# Altium schematic sheet FIT_CONN.SchDoc
size A4; SheetNumber: 24; SheetTotal: 29
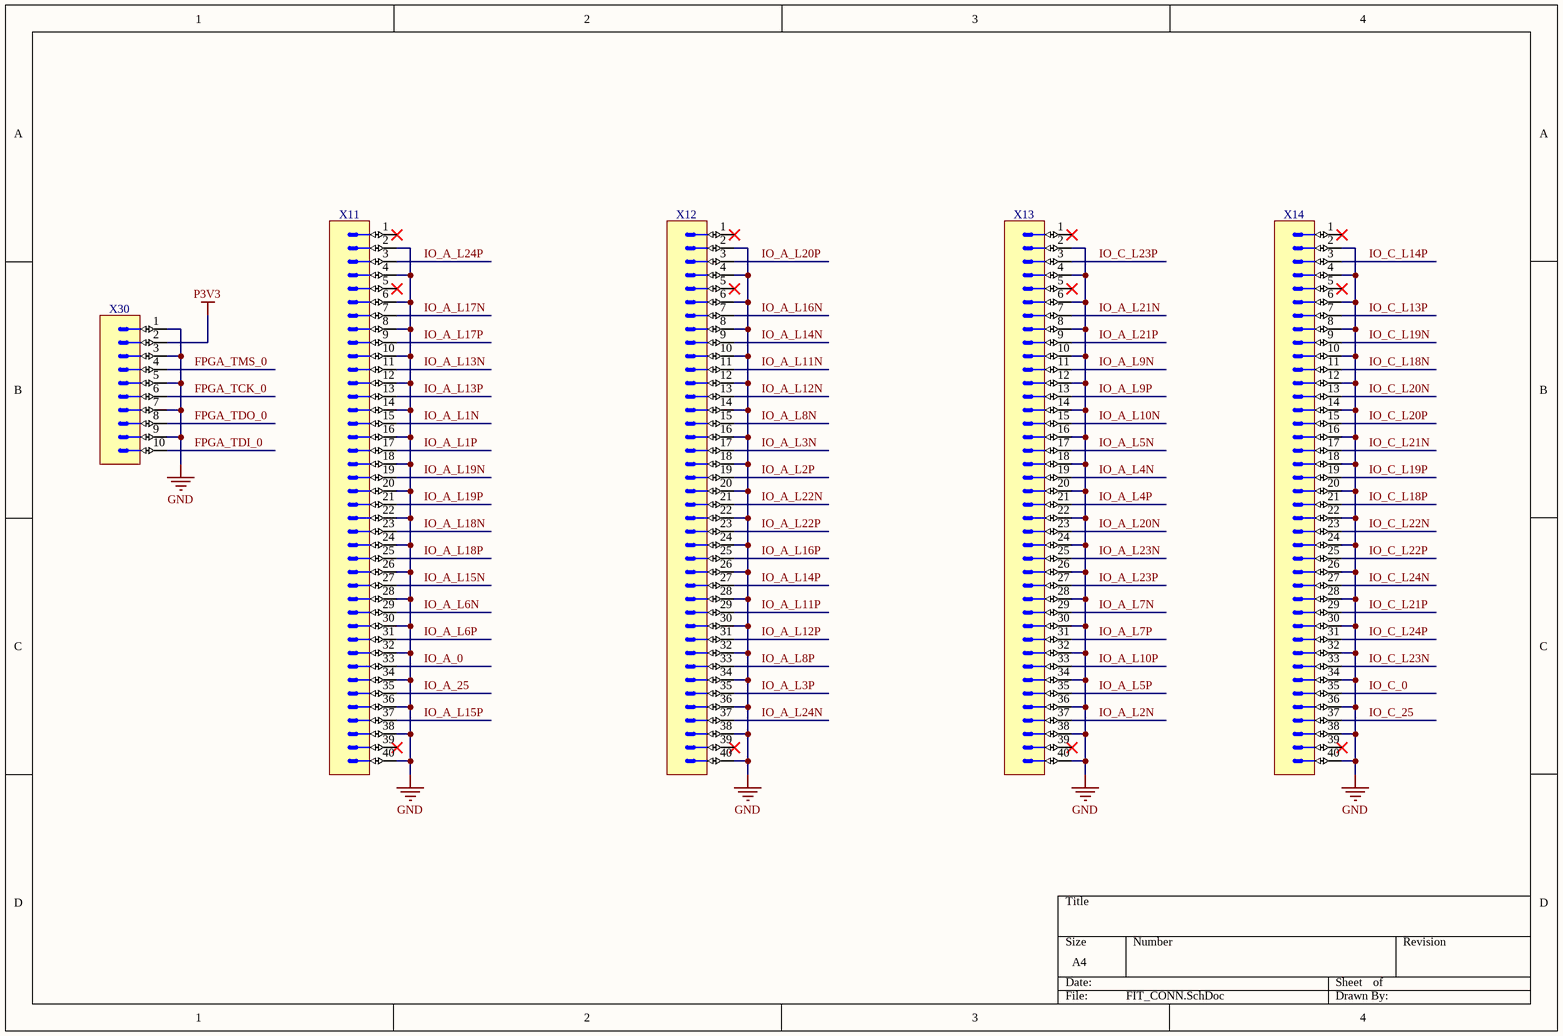
[diagram p0: FIT_CONN.SchDoc]

## Parts
X11  (no value)  [CONNFLY_DS1013-40SSIB1-B-0]
X12  (no value)  [CONNFLY_DS1013-40SSIB1-B-0]
X13  (no value)  [CONNFLY_DS1013-40SSIB1-B-0]
X14  (no value)  [CONNFLY_DS1013-40SSIB1-B-0]
X30  (no value)  [CONNFLY_DS1014-10SF1B-B]

## Nets
GND: X11.2 X11.4 X11.6 X11.8 X11.10 X11.12 X11.14 X11.16 X11.18 X11.20 X11.22 X11.24 X11.26 X11.28 X11.30 X11.32 X11.34 X11.36 X11.38 X11.40 X12.2 X12.4 X12.6 X12.8 X12.10 X12.12 X12.14 X12.16 X12.18 X12.20 X12.22 X12.24 X12.26 X12.28 X12.30 X12.32 X12.34 X12.36 X12.38 X12.40 X13.2 X13.4 X13.6 X13.8 X13.10 X13.12 X13.14 X13.16 X13.18 X13.20 X13.22 X13.24 X13.26 X13.28 X13.30 X13.32 X13.34 X13.36 X13.38 X13.40 X14.2 X14.4 X14.6 X14.8 X14.10 X14.12 X14.14 X14.16 X14.18 X14.20 X14.22 X14.24 X14.26 X14.28 X14.30 X14.32 X14.34 X14.36 X14.38 X14.40 X30.1 X30.3 X30.5 X30.7 X30.9
P3V3: X30.2
FPGA_TCK_0: X30.6
FPGA_TDI_0: X30.10
FPGA_TDO_0: X30.8
FPGA_TMS_0: X30.4
IO_A_0: X11.33
IO_A_25: X11.35
IO_A_L1N: X11.15
IO_A_L1P: X11.17
IO_A_L2N: X13.37
IO_A_L2P: X12.19
IO_A_L3N: X12.17
IO_A_L3P: X12.35
IO_A_L4N: X13.19
IO_A_L4P: X13.21
IO_A_L5N: X13.17
IO_A_L5P: X13.35
IO_A_L6N: X11.29
IO_A_L6P: X11.31
IO_A_L7N: X13.29
IO_A_L7P: X13.31
IO_A_L8N: X12.15
IO_A_L8P: X12.33
IO_A_L9N: X13.11
IO_A_L9P: X13.13
IO_A_L10N: X13.15
IO_A_L10P: X13.33
IO_A_L11N: X12.11
IO_A_L11P: X12.29
IO_A_L12N: X12.13
IO_A_L12P: X12.31
IO_A_L13N: X11.11
IO_A_L13P: X11.13
IO_A_L14N: X12.9
IO_A_L14P: X12.27
IO_A_L15N: X11.27
IO_A_L15P: X11.37
IO_A_L16N: X12.7
IO_A_L16P: X12.25
IO_A_L17N: X11.7
IO_A_L17P: X11.9
IO_A_L18N: X11.23
IO_A_L18P: X11.25
IO_A_L19N: X11.19
IO_A_L19P: X11.21
IO_A_L20N: X13.23
IO_A_L20P: X12.3
IO_A_L21N: X13.7
IO_A_L21P: X13.9
IO_A_L22N: X12.21
IO_A_L22P: X12.23
IO_A_L23N: X13.25
IO_A_L23P: X13.27
IO_A_L24N: X12.37
IO_A_L24P: X11.3
IO_C_0: X14.35
IO_C_25: X14.37
IO_C_L13P: X14.7
IO_C_L14P: X14.3
IO_C_L18N: X14.11
IO_C_L18P: X14.21
IO_C_L19N: X14.9
IO_C_L19P: X14.19
IO_C_L20N: X14.13
IO_C_L20P: X14.15
IO_C_L21N: X14.17
IO_C_L21P: X14.29
IO_C_L22N: X14.23
IO_C_L22P: X14.25
IO_C_L23N: X14.33
IO_C_L23P: X13.3
IO_C_L24N: X14.27
IO_C_L24P: X14.31

Not connected (* = marked no-connect by the designer): X11 1* 5* 39*; X12 1* 5* 39*; X13 1* 5* 39*; X14 1* 5* 39*

## Library data of the parts
X11-X14 = CONNFLY_DS1013-40SSIB1-B-0: Connector 40 Male; Part Description: 40 Contacts, 2.54mm Box Header V/T,R/A & SMT Type; PressFit: No; Part Number: CONNFLY_DS1013-40SSIB1-B-0; Component Kind: Standard; Component Type: Standard; Pin Count: 40; Mounted: Yes; Socket: No; SMD: No; Sense: No; Status: None; Manufacturer: CONNFLY; Manufacturer Part Number: DS1013-40SSIB1-B-0; ComponentHeight: 9.1mm; HelpURL: \\cern.ch\dfs\Applications\Altium\Datasheets\CONNFLY_DS1013.pdf; Author: CERN DEM HF; CreateDate: 30.05.2024; LatestRevisionDate: 30.05.2024
X30 = CONNFLY_DS1014-10SF1B-B: Connector 10 Male; Part Description: 10 Contacts, 2.00mm Box Header V/T,R/A & SMT Type; PressFit: No; Part Number: CONNFLY_DS1014-10SF1B-B; Component Kind: Standard; Component Type: Standard; Pin Count: 10; Mounted: Yes; Socket: No; SMD: No; Sense: No; Status: None; Manufacturer: CONNFLY; Manufacturer Part Number: DS1014-10SF1B-B; ComponentHeight: 5.6mm; HelpURL: \\cern.ch\dfs\Applications\Altium\Datasheets\CONNFLY_DS1014-10SF1B-B.pdf; Author: CERN DEM HF; CreateDate: 29.05.2024; LatestRevisionDate: 29.05.2024